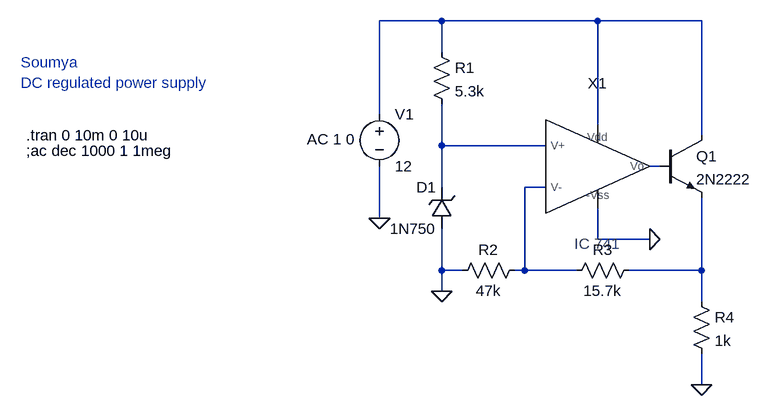
[diagram p0: schematic dc supply.asc]
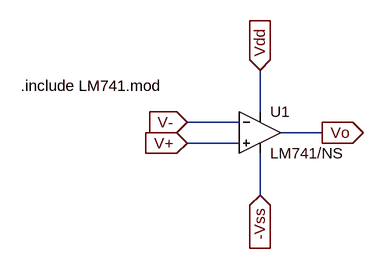
[diagram p1: sub-circuit ic741.asc]
dc supply.asc, the LTspice schematic file:
Version 4
SHEET 1 880 680
WIRE 176 -96 80 -96
WIRE 416 -96 176 -96
WIRE 576 -96 416 -96
WIRE 176 -48 176 -96
WIRE 80 48 80 -96
WIRE 416 64 416 -96
WIRE 576 80 576 -96
WIRE 176 96 176 32
WIRE 336 96 176 96
WIRE 512 128 496 128
WIRE 176 160 176 96
WIRE 336 160 304 160
WIRE 80 208 80 128
WIRE 416 240 416 192
WIRE 496 240 416 240
WIRE 176 288 176 224
WIRE 208 288 176 288
WIRE 304 288 304 160
WIRE 304 288 288 288
WIRE 384 288 304 288
WIRE 576 288 576 176
WIRE 576 288 464 288
WIRE 176 320 176 288
WIRE 576 336 576 288
WIRE 576 464 576 416
FLAG 80 208 0
FLAG 176 320 0
FLAG 576 464 0
FLAG 496 240 0
SYMBOL voltage 80 32 R0
WINDOW 123 -111 54 Left 2
WINDOW 39 0 0 Left 0
SYMATTR Value2 AC 1 0
SYMATTR InstName V1
SYMATTR Value 12
SYMBOL IC741 416 144 R0
SYMATTR InstName X1
SYMBOL zener 192 224 R180
WINDOW 0 24 64 Left 2
WINDOW 3 24 0 Left 2
SYMATTR InstName D1
SYMATTR Value 1N750
SYMATTR Description Diode
SYMATTR Type diode
SYMBOL res 160 -64 R0
SYMATTR InstName R1
SYMATTR Value 5.3k
SYMBOL npn 512 80 R0
SYMATTR InstName Q1
SYMATTR Value 2N2222
SYMBOL res 304 272 R90
WINDOW 0 0 56 VBottom 2
WINDOW 3 32 56 VTop 2
SYMATTR InstName R2
SYMATTR Value 47k
SYMBOL res 480 272 R90
WINDOW 0 0 56 VBottom 2
WINDOW 3 32 56 VTop 2
SYMATTR InstName R3
SYMATTR Value 15.7k
SYMBOL res 560 320 R0
SYMATTR InstName R4
SYMATTR Value 1k
TEXT -464 80 Left 2 !.tran 0 10m 0 10u
TEXT -464 104 Left 2 !;ac dec 1000 1 1meg
TEXT -472 -32 Left 2 ;Soumya \nDC regulated power supply

ic741.asc, the sub-circuit schematic file:
Version 4
SHEET 1 880 680
WIRE 368 128 368 64
WIRE 336 144 256 144
WIRE 464 160 400 160
WIRE 336 176 256 176
WIRE 368 256 368 192
FLAG 464 160 Vo
IOPIN 464 160 Out
FLAG 368 64 Vdd
IOPIN 368 64 In
FLAG 368 256 -Vss
IOPIN 368 256 In
FLAG 256 176 V+
IOPIN 256 176 In
FLAG 256 144 V-
IOPIN 256 144 In
SYMBOL OpAmps\\opamp2 368 96 R0
SYMATTR InstName U1
SYMATTR Value LM741/NS
TEXT 0 88 Left 2 !.include LM741.mod

The netlist it stands for:
* dc supply.asc
V1 N001 0 12 AC 1 0
XX1 0 N002 N004 N001 N003 ic741
D1 0 N002 1N750
R1 N001 N002 5.3k
Q1 N001 N003 N005 0 2N2222
R2 N004 0 47k
R3 N005 N004 15.7k
R4 N005 0 1k

* block symbol definitions
.subckt ic741 -Vss V+ V- Vdd Vo
XU1 V+ V- Vdd -Vss Vo LM741/NS  ; pins In+ In- V+ V- OUT
.include LM741.mod
.ends ic741

.model D D
.lib standard.dio
.model NPN NPN
.model PNP PNP
.lib standard.bjt
.tran 0 10m 0 10u
;ac dec 1000 1 1meg
* Soumya
* DC regulated power supply
.backanno
.end